# Altium schematic sheet power.SchDoc
size A4
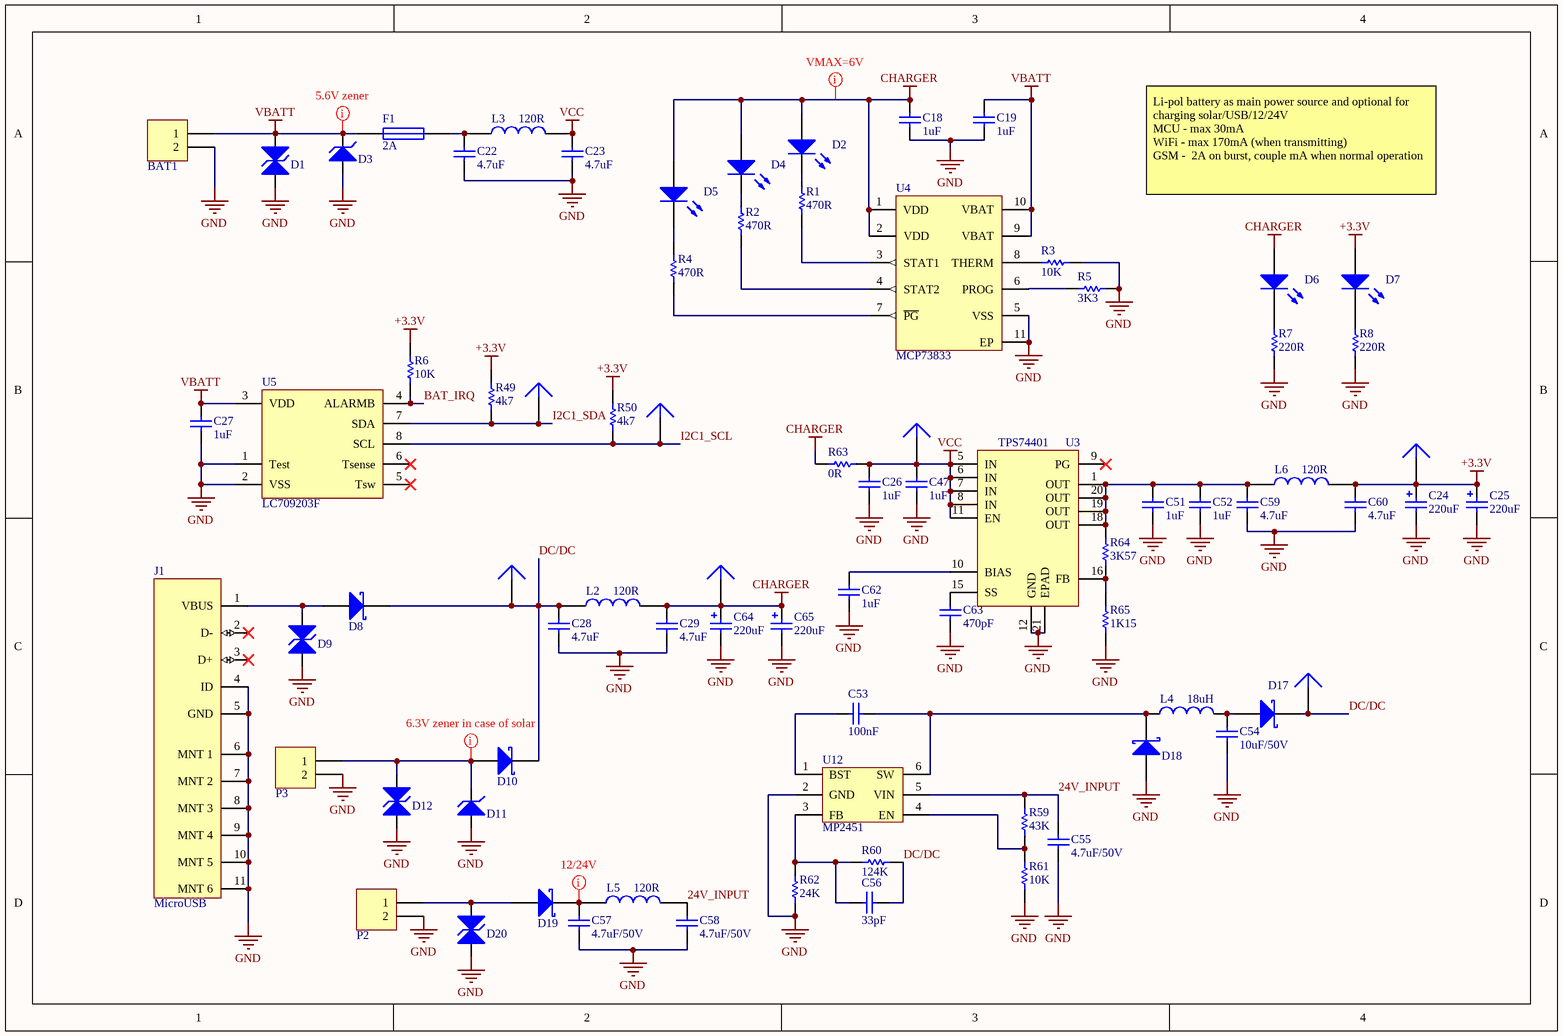
[diagram p0: power.SchDoc]

## Parts
BAT1  Header 2  [HDR1X2]  (value not drawn)
C18  value 1uF  [C0402]  (hidden comment: Cap 1uF)
C19  value 1uF  [C0402]  (hidden comment: Cap 1uF)
C22  value 4.7uF  [C0402]  (hidden comment: Cap 4.7uF)
C23  value 4.7uF  [C0402]  (hidden comment: Cap 4.7uF)
C24  value 220uF  [CAP-D]  (hidden comment: Tantalum 220uF)
C25  value 220uF  [CAP-D]  (hidden comment: Tantalum 220uF)
C26  value 1uF  [C0402]  (hidden comment: Cap 1uF)
C27  value 1uF  [C0402]  (hidden comment: Cap 1uF)
C28  value 4.7uF  [C0402]  (hidden comment: Cap 4.7uF)
C29  value 4.7uF  [C0402]  (hidden comment: Cap 4.7uF)
C47  value 1uF  [C0402]  (hidden comment: Cap 1uF)
C51  value 1uF  [C0402]  (hidden comment: Cap 1uF)
C52  value 1uF  [C0402]  (hidden comment: Cap 1uF)
C53  value 100nF  [C0402]  (hidden comment: Cap 100nF)
C54  value 10uF/50V  [C1206]  (hidden comment: Cap 10uF/50V)
C55  value 4.7uF/50V  [C1206]  (hidden comment: Cap 4.7uF/50V)
C56  value 33pF  [C0402]  (hidden comment: Cap 33pF)
C57  value 4.7uF/50V  [C1206]  (hidden comment: Cap 4.7uF/50V)
C58  value 4.7uF/50V  [C1206]  (hidden comment: Cap 4.7uF/50V)
C59  value 4.7uF  [C0402]  (hidden comment: Cap 4.7uF)
C60  value 4.7uF  [C0402]  (hidden comment: Cap 4.7uF)
C62  value 1uF  [C0402]  (hidden comment: Cap 1uF)
C63  value 470pF  [C0402]  (hidden comment: Cap 470pF)
C64  value 220uF  [CAP-D]  (hidden comment: Tantalum 220uF)
C65  value 220uF  [CAP-D]  (hidden comment: Tantalum 220uF)
D1  TVS Bidirectional  [SMA]  (value not drawn)
D2  LED  [0603LedRed]  (value not drawn)
D3  Zener Diode  [miniMELF]  (value not drawn)
D4  LED  [0603LedRed]  (value not drawn)
D5  LED  [0603LedRed]  (value not drawn)
D6  LED  [0603LedRed]  (value not drawn)
D7  LED  [0603LedRed]  (value not drawn)
D8  STPS1L30U  [SOD-123A]  (value not drawn)
D9  TVS Bidirectional  [SMA]  (value not drawn)
D10  STPS1L30U  [SOD-123A]  (value not drawn)
D11  Zener Diode  [miniMELF]  (value not drawn)
D12  TVS Bidirectional  [SMA]  (value not drawn)
D17  D Schottky  [SOD-123A]  (value not drawn)
D18  STPS1L30U  [SOD-123A]  (value not drawn)
D19  STPS1L30U  [SOD-123A]  (value not drawn)
D20  TVS Bidirectional  [SMA]  (value not drawn)
F1  2A  [R1206]
J1  MicroUSB  [MicroUSB]
L2  120R  [0805FerriteBead]
L3  120R  [0805FerriteBead]
L4  value 18uH  [WE-TPC_4828]  (hidden comment: Inductor 18uH)
L5  120R  [0805FerriteBead]
L6  120R  [0805FerriteBead]
P2  Header 2  [HDR1x2_screw]  (value not drawn)
P3  Header 2  [HDR1x2_screw]  (value not drawn)
P12  Plug  [pin smd]  (value not drawn)  (no BOM)
P13  Plug  [pin smd]  (value not drawn)  (no BOM)
P15  Plug  [pin smd]  (value not drawn)  (no BOM)
P16  Plug  [pin smd]  (value not drawn)  (no BOM)
P17  Plug  [pin smd]  (value not drawn)  (no BOM)
P18  Plug  [pin smd]  (value not drawn)  (no BOM)
P19  Plug  [pin smd]  (value not drawn)  (no BOM)
R1  value 470R  [R0402]  (hidden comment: Res_470R)
R2  value 470R  [R0402]  (hidden comment: Res_470R)
R3  value 10K  [R0402]  (hidden comment: Res_10K)
R4  value 470R  [R0402]  (hidden comment: Res_470R)
R5  value 3K3  [R0402]  (hidden comment: Res_3K3)
R6  value 10K  [R0402]  (hidden comment: Res_10K)
R7  value 220R  [R0402]  (hidden comment: Res_220R)
R8  value 220R  [R0402]  (hidden comment: Res_220R)
R49  value 4k7  [R0402]  (hidden comment: Res_4k7)
R50  value 4k7  [R0402]  (hidden comment: Res_4k7)
R59  value 43K  [R0402]  (hidden comment: Res_43K)
R60  value 124K  [R0402]  (hidden comment: Res_124K)
R61  value 10K  [R0402]  (hidden comment: Res_10K)
R62  value 24K  [R0402]  (hidden comment: Res_24K)
R63  value 0R  [R0402]  (hidden comment: Res_0R)
R64  value 3K57  [R0402]  (hidden comment: Res_3K57)
R65  value 1K15  [R0402]  (hidden comment: Res_1K15)
U3  TPS74401  [PVQFN20]
U4  MCP73833  [DFN 3x3]
U5  LC709203F  [WDFN8]
U12  MP2451  [SOT23-6]

## Nets
+3.3V: C24.2 C25.2 C60.2 D7.1(A) L6.2 P16.1 R6.2 R49.2 R50.2
CHARGER: C18.2 C29.2 C64.2 C65.2 D2.1(A) D4.1(A) D5.1(A) D6.1(A) L2.2 P18.1 R63.1 U4.1(VDD) U4.2(VDD)
GND: BAT1.2 C18.1 C19.1 C22.1 C23.1 C24.1 C25.1 C26.1 C27.1 C28.1 C29.1 C47.1 C51.1 C52.1 C54.1 C55.1 C57.1 C58.1 C59.1 C60.1 C62.1 C63.1 C64.1 C65.1 D1.1 D3.1(A) D9.1 D11.1(A) D12.1 D18.1(A) D20.1 J1.4(ID) J1.5(GND) J1.6(MNT_1) J1.7(MNT_2) J1.8(MNT_3) J1.9(MNT_4) J1.10(MNT_5) J1.11(MNT_6) P2.2 P3.2 R3.2 R5.2 R7.1 R8.1 R61.1 R62.1 R65.1 U3.12(GND) U3.21(EPAD) U4.5(VSS) U4.11(EP) U5.1(Test) U5.2(VSS) U12.2(GND)
VBATT: BAT1.1 C19.2 C27.2 D1.2 D3.2(K) F1.1 U4.9(VBAT) U4.10(VBAT) U5.3(VDD)
VCC: C23.2 C26.2 C47.2 L3.2 P15.1 R63.2 U3.5(IN) U3.6(IN) U3.7(IN) U3.8(IN) U3.11(EN)
24V_INPUT: C55.2 C58.2 L5.2 R59.2 U12.5(VIN)
BAT_IRQ: R6.1 U5.4(ALARMB)
DC/DC: C28.2 C56.2 D8.2(K) D10.2(K) D17.2(K) L2.1 P17.1 P19.1 R60.2
I2C1_SCL: P13.1 R50.1 U5.8(SCL)
I2C1_SDA: P12.1 R49.1 U5.7(SDA)
NetC22_2: C22.2 F1.2 L3.1
NetC51_2: C51.2 C52.2 C59.2 L6.1 R64.2 U3.1(OUT) U3.18(OUT) U3.19(OUT) U3.20(OUT)
NetC53_1: C53.1 U12.1(BST)
NetC53_2: C53.2 D18.2(K) L4.1 U12.6(SW)
NetC54_2: C54.2 D17.1(A) L4.2
NetC56_1: C56.1 R60.1 R62.2 U12.3(FB)
NetC57_2: C57.2 D19.2(K) L5.1
NetC62_2: C62.2 U3.10(BIAS)
NetC63_2: C63.2 U3.15(SS)
NetD2_2: D2.2(K) R1.2
NetD4_2: D4.2(K) R2.2
NetD5_2: D5.2(K) R4.2
NetD6_2: D6.2(K) R7.2
NetD7_2: D7.2(K) R8.2
NetD8_1: D8.1(A) D9.2 J1.1(VBUS)
NetD10_1: D10.1(A) D11.2(K) D12.2 P3.1
NetD19_1: D19.1(A) D20.2 P2.1
NetR1_1: R1.1 U4.3(STAT1)
NetR2_1: R2.1 U4.4(STAT2)
NetR3_1: R3.1 U4.8(THERM)
NetR4_1: R4.1 U4.7(~{PG})
NetR5_1: R5.1 U4.6(PROG)
NetR59_1: R59.1 R61.2 U12.4(EN)
NetR64_1: R64.1 R65.2 U3.16(FB)

Not connected (* = marked no-connect by the designer): J1 2(D-)* 3(D+)*; U3 9(PG)*; U5 5(Tsw)* 6(Tsense)*

## Layout directives
mark named 6.3V zener in case of solar: NetD10_1
mark named 5.6V zener: VBATT
mark named VMAX=6V: CHARGER
mark named 12/24V: NetC57_2

## Notes on the sheet
- Li-pol battery as main power source and optional for charging solar/USB/12/24V
  MCU - max 30mA
  WiFi - max 170mA (when transmitting)
  GSM -  2A on burst, couple mA when normal operation

## Library data of the parts
BAT1 P2 P3 = Header 2: Header, 2-Pin; LatestRevisionDate: 17-Jul-2002; LatestRevisionNote: Re-released for DXP Platform.; Publisher: Altium Limited
C18 C19 C26 C27 C47 C51 C52 C62 = Cap 1uF: Capacitor
C22 C23 C28 C29 C59 C60 = Cap 4.7uF: Capacitor
C24 C25 C64 C65 = Tantalum 220uF: Polarized Tantalum Capacitor
C53 = Cap 100nF: Capacitor
C54 = Cap 10uF/50V: Capacitor
C55 C57 C58 = Cap 4.7uF/50V: Capacitor
C56 = Cap 33pF: Capacitor
C63 = Cap 470pF: Capacitor
D1 D9 D12 D20 = TVS_bidirectional: SMAJ40CA; Published: 8-Jun-2000; LatestRevisionDate: 17-Jul-2002; LatestRevisionNote: Re-released for DXP Platform.; PackageReference: DIODE-0.7; Publisher: Altium Limited; PackageDescription: Diode, Thru-Hole; 2 Leads; 0.7 in Pin Spacing; ComponentLink1Description: datasheet; ComponentLink1URL: https://datasheet.lcsc.com/szlcsc/1912111437_Jiangsu-JieJie-Microelectronics-SMAJ40CA_C364660.pdf
D2 D4-D7 = LED: Typical RED GaAs LED; Published: 8-Jun-2000; LatestRevisionDate: 08-Jul-2005; LatestRevisionNote: Mech Layer 1 removed.; PackageReference: LED-1; Publisher: Altium Limited; PackageDescription: LED; 2 Leads
D3 D11 = Diode Zener: Published: 8-Jun-2000; LatestRevisionDate: 17-Jul-2002; LatestRevisionNote: Re-released for DXP Platform.; PackageReference: DIODE-0.7; Publisher: Altium Limited; PackageDescription: Diode, Thru-Hole; 2 Leads; 0.7 in Pin Spacing; ComponentLink1Description: farnell; ComponentLink1URL: https://pl.farnell.com/on-semiconductor/mm3z5v6st1g/zener-diode-5-6v-sod-323/dp/2463484
D8 D10 D18 D19 = Diode Schottky: Schottky Rectifier; Note: Terminal 2 is the TAB and is electrically connected to the cathode; Published: 8-Jun-2000; LatestRevisionDate: 17-Jul-2002; LatestRevisionNote: Re-released for DXP Platform.; DatasheetVersion: Dec-1997; PackageVersion: Feb-1998; PackageReference: TO-220AC; Publisher: Altium Limited; PackageDescription: TO, Thru-Hole, Vertical, Heatsink Mounted; 3 In-Line Leads (1 Absent); Pitch 2.54 mm; ComponentLink1Description: octopart; ComponentLink1URL: https://octopart.com/rb161mm-20tr-rohm-50255147?r=sp&s=49MKJYpmTviEGZkvRDL2JQ
D17 = D Schottky: Schottky Diode; Published: 8-Jun-2000; LatestRevisionDate: 17-Jul-2002; LatestRevisionNote: Re-released for DXP Platform.; PackageReference: SMB; Publisher: Altium Limited; PackageDescription: DO-214-AA/SMB; 2 C-Bend Leads; Body 5.3 x 3.6 mm, inc. leads (LxW); Code_JEDEC: DO-214-AA
F1 = Fuse_2A: Fuse / 2850030; Published: 8-Jun-2000; LatestRevisionDate: 17-Jul-2002; LatestRevisionNote: Re-released for DXP Platform.; PackageReference: PIN-W2/E2.8; Publisher: Altium Limited; PackageDescription: Thru-Hole; 2 Leads; ComponentLink1Description: farnell; ComponentLink1URL: https://pl.farnell.com/multicomp/mccfb1206ttt-2/fuse-smd-2a-slow-blow-1206/dp/2850030
L2 L3 L5 L6 = Ferrite bead 120R: Ferrite bead; Value: 10mH; Published: 24-Mar-1999; LatestRevisionDate: 17-Jul-2002; LatestRevisionNote: Re-released for DXP Platform.; PackageReference: AXIAL-0.9; Publisher: Altium Limited; PackageDescription: Axial Device, Thru-Hole; 2 Leads; 0.9 in Pin Spacing; ComponentLink1Description: Ferrite bead TDK MMZ2012Y300B; ComponentLink1URL: https://www.tme.eu/pl/details/mmz2012y300b/ferryty-koraliki/tdk/
L4 = Inductor 18uH: WE 744 043 180; Code_IEC: 1005; Published: 8-Jun-2000; LatestRevisionDate: 29-May-2009; LatestRevisionNote: IPC-7351 Footprint Added.; PackageReference: 0402-A; Publisher: Altium Limited; PackageDescription: Chip Inductor; Code_JEITA: 0402
R1 R2 R4 = Res_470R: Resistor
R3 R6 R61 = Res_10K: Resistor
R5 = Res_3K3: Resistor
R7 R8 = Res_220R: Resistor
R49 R50 = Res_4k7: Resistor
R59 = Res_43K: Resistor
R60 = Res_124K: Resistor
R62 = Res_24K: Resistor
R63 = Res_0R: Resistor
R64 = Res_3K57: Resistor
R65 = Res_1K15: Resistor
U3 = TPS74401: Very Low Dropout Regulator; ComponentLink1Description: datasheet; ComponentLink1URL: https://datasheet.lcsc.com/szlcsc/Texas-Instruments-TI-TPS74401RGWR_C138728.pdf
U4 = MCP73833: Li-Ion, Li-Polymer Charge Management Controller; PartNumber: MCP73831T-2ATI/OT; PackageDescription: 5-Lead Plastic Small Outline Transistor (OT) [SOT-23]; PackageVersion: revBB, Aug-2009; DatasheetVersion: revE, Sep-2008; Code_IPC: SOT23-5; PackageReference: SOT-23-OT5; ComponentLink1Description: octopart; ComponentLink1URL: https://octopart.com/mcp73833-fci%2Fmf-microchip-664198?r=sp&s=e45vLxEIQu2vH537JitsJQ
U5 = LC709203F: Smart LiB GaugeBattery Fuel Gauge LSI For 1‐Cell Lithium‐ion/Polymer (Li+); ComponentLink1Description: Datasheet; ComponentLink1URL: https://www.onsemi.com/pub/Collateral/LC709203F-D.PDF
U12 = MP2451: step down coverter; ComponentLink1Description: datasheet; ComponentLink1URL: https://www.monolithicpower.com/en/documentview/productdocument/index/version/2/document_type/Datasheet/lang/en/sku/MP2451/document_id/253/
J1 = MicroUSB: ComponentLink1Description: octopart; ComponentLink1URL: https://octopart.com/1050170001-molex-11866487?r=sp&s=Rj0fqO-uQZ6OfaPf4COaug
P12 P13 P15-P19 = Plug: LatestRevisionDate: 17-Jul-2002; LatestRevisionNote: Re-released for DXP Platform.; Publisher: Altium Limited